# EasyEDA schematic SCH_Minisumo-camara_2026-01-12.json
TITLE: Sheet_1; REV: 1.0; Date: 2025-10-06; Sheet: 1/1; Drawn By: holgersanmartin; Company: Your Company
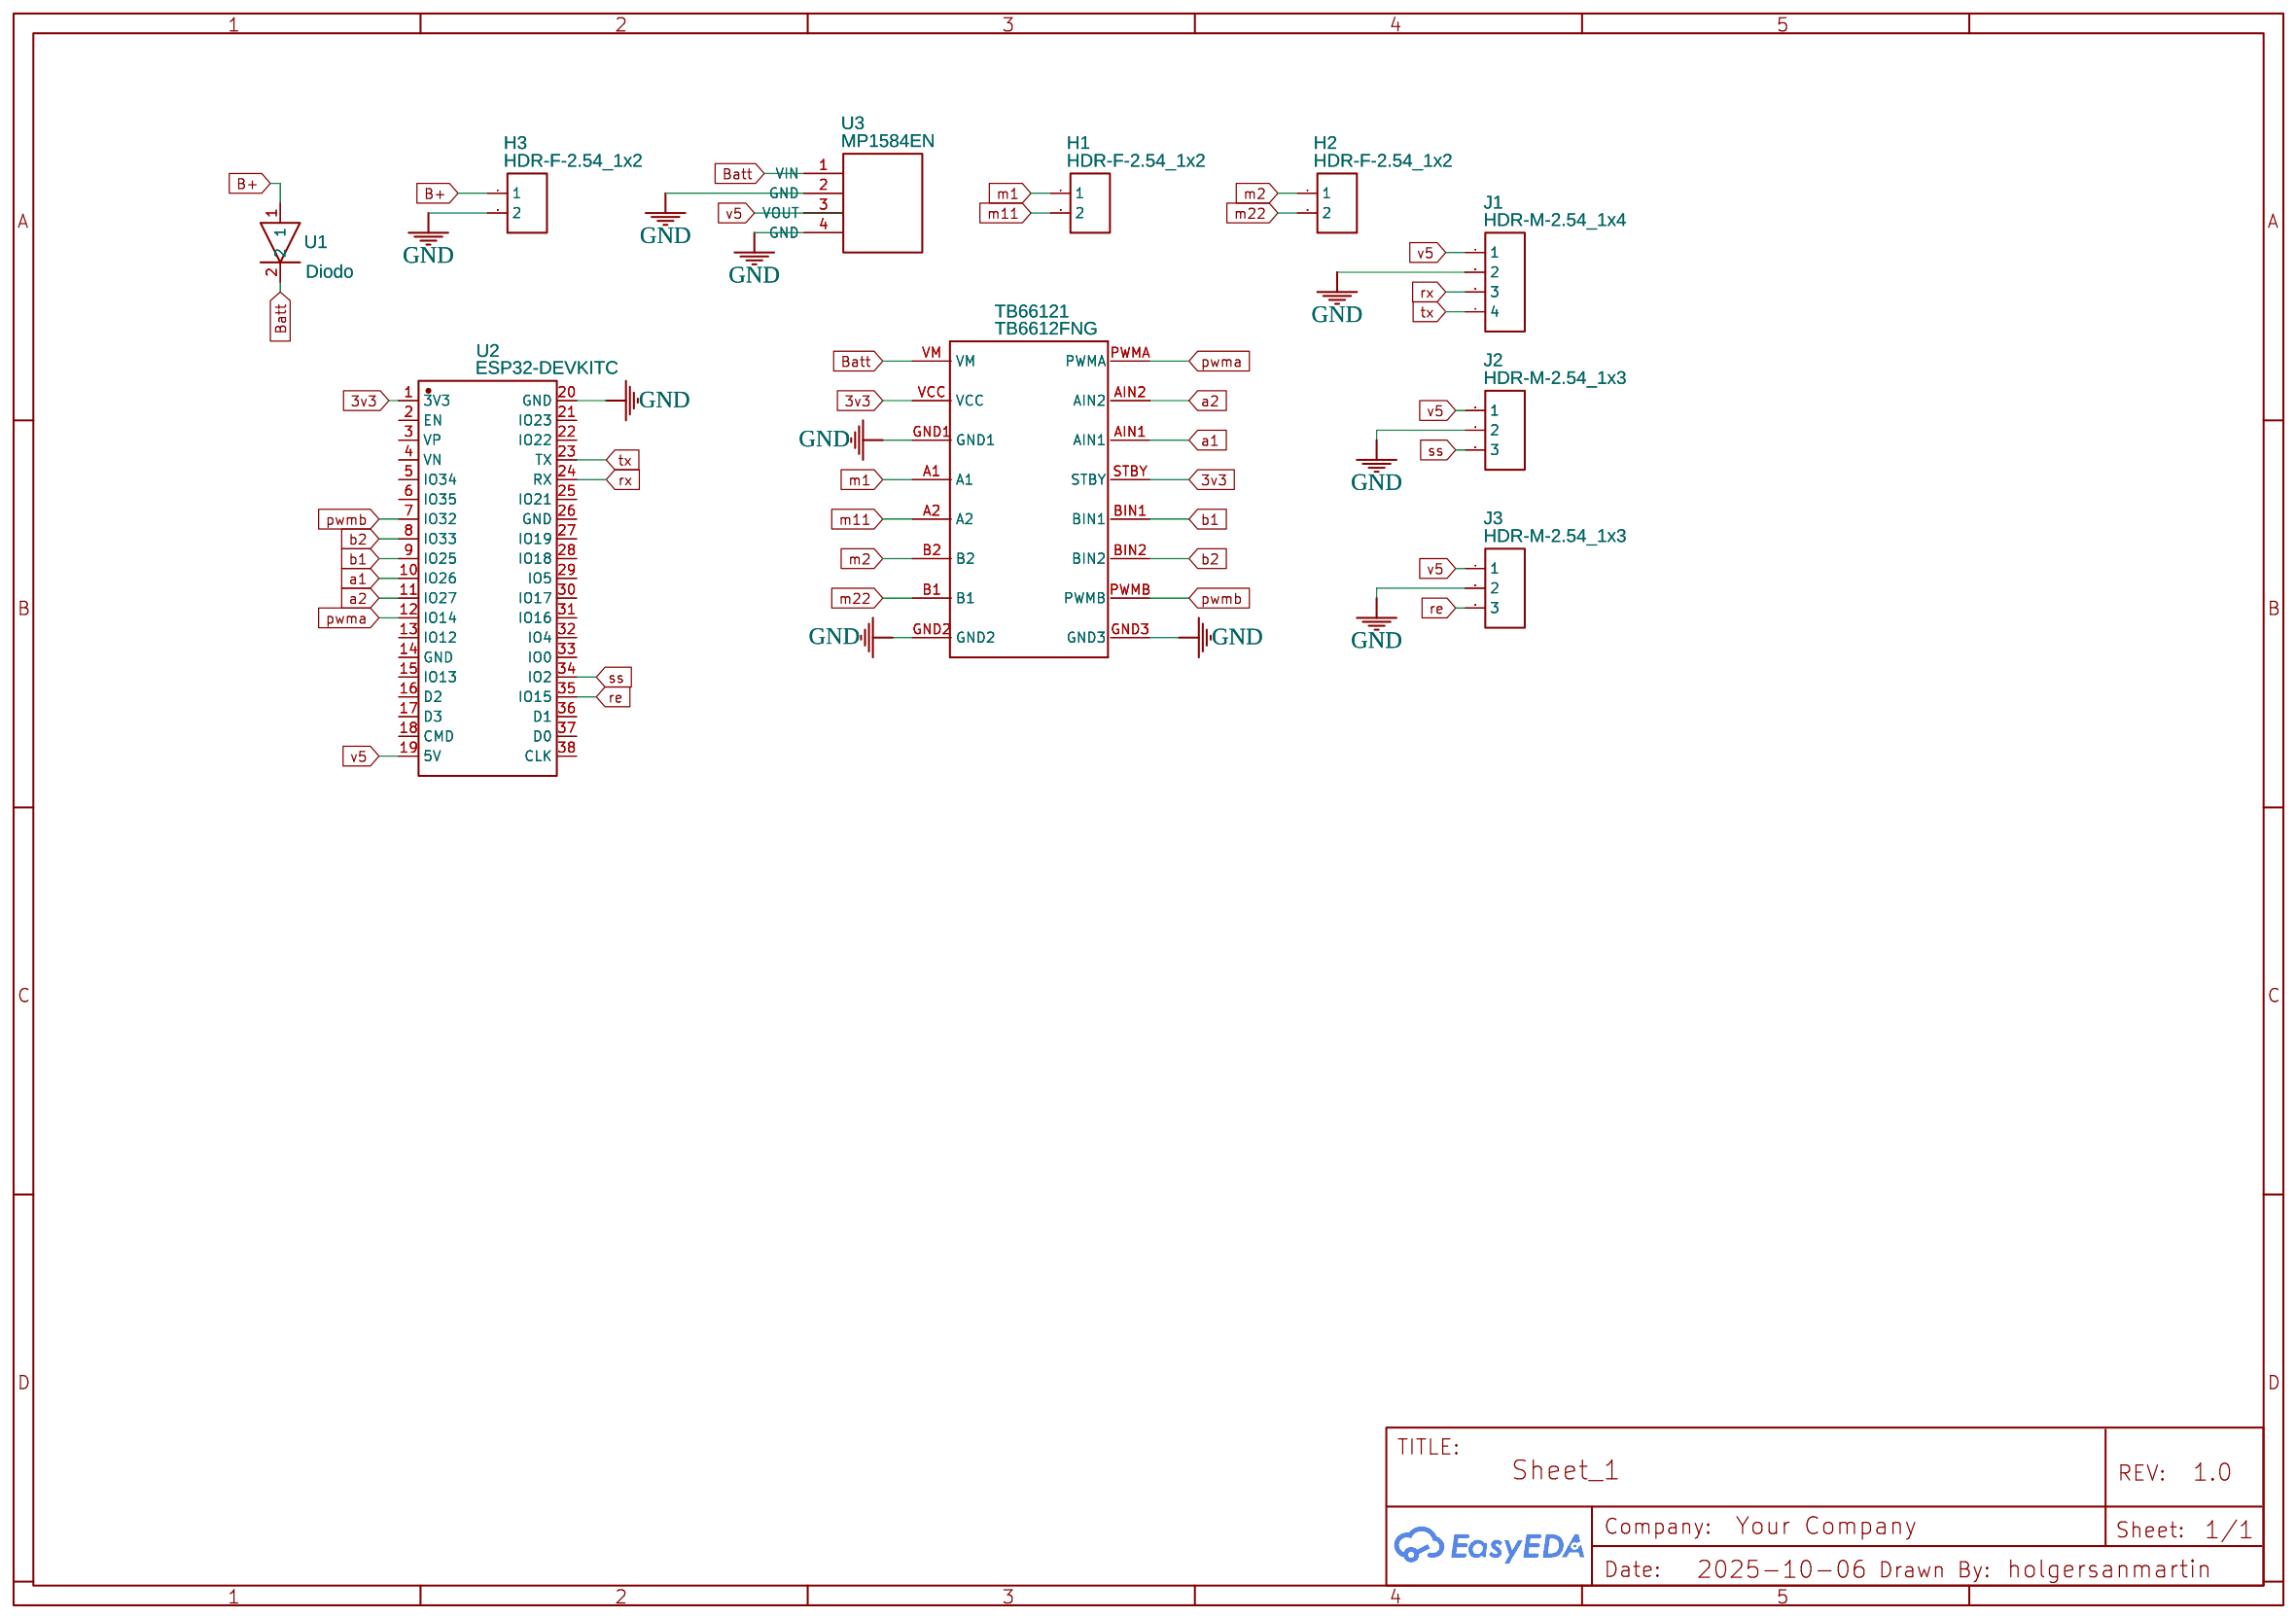
[diagram p0: schematic sheet]

## Parts
H1  HDR-F-2.54_1x2  [HDR-F-2.54_1X2]
H2  HDR-F-2.54_1x2  [HDR-F-2.54_1X2]
H3  HDR-F-2.54_1x2  [HDR-F-2.54_1X2]
J1  HDR-M-2.54_1x4  [HDR-M-2.54_1X4]
J2  HDR-M-2.54_1x3  [HDR-M-2.54_1X3]
J3  HDR-M-2.54_1x3  [HDR-M-2.54_1X3]
TB66121  TB6612FNG  [TB6612FNG]
U1  Diodo  [DIODO]
U2  ESP32-DEVKITC  [BULETM-SMD_ESP32-DEVKITC]
U3  MP1584EN  [MP1584EN]

## Library data of the parts
H1-H3 = HDR-F-2.54_1x2: Supplier Part: C49661; Supplier: LCSC; Contributor: LCEDA_Lib
J1 = HDR-M-2.54_1x4: Supplier Part: C124378; Supplier: LCSC; Contributor: LCEDA_Lib
J2 J3 = HDR-M-2.54_1x3: Supplier Part: C180248; Supplier: LCSC; Contributor: LCEDA_Lib
TB66121 = TB6612FNG: Contributor: Shreenath Bohra
U1 = Diodo: Contributor: russo.maximiliano.ariel
U2 = ESP32-DEVKITC: Supplier: LCSC; Supplier Part: C571180; Manufacturer: ESPRESSIF(乐鑫); Manufacturer Part: ESP32-DevKitC; Contributor: lcsc; JLCPCB Part Class: Extended Part
U3 = MP1584EN: Contributor: Sceagloriette

## Nets
3v3: TB66121.STBY TB66121.VCC U2.1(3V3)
GND: H3.2 J1.2 J2.2 J3.2 TB66121.GND1 TB66121.GND2 TB66121.GND3 U2.20(GND) U3.2(GND) U3.4(GND)
v5: J1.1 J2.1 J3.1 U2.19(5V) U3.3(VOUT)
a1: TB66121.AIN1 U2.10(IO26)
a2: TB66121.AIN2 U2.11(IO27)
b1: TB66121.BIN1 U2.9(IO25)
b2: TB66121.BIN2 U2.8(IO33)
B+: H3.1 U1.1
Batt: TB66121.VM U1.2 U3.1(VIN)
m1: H1.1 TB66121.A1
m2: H2.1 TB66121.B2
m11: H1.2 TB66121.A2
m22: H2.2 TB66121.B1
pwma: TB66121.PWMA U2.12(IO14)
pwmb: TB66121.PWMB U2.7(IO32)
re: J3.3 U2.35(IO15)
rx: J1.3 U2.24(RX)
ss: J2.3 U2.34(IO2)
tx: J1.4 U2.23(TX)

Not connected (* = marked no-connect by the designer): U2 2(EN) 3(VP) 4(VN) 5(IO34) 6(IO35) 13(IO12) 14(GND) 15(IO13) 16(D2) 17(D3) 18(CMD) 21(IO23) 22(IO22) 25(IO21) 26(GND) 27(IO19) 28(IO18) 29(IO5) 30(IO17) 31(IO16) 32(IO4) 33(IO0) 36(D1) 37(D0) 38(CLK)
